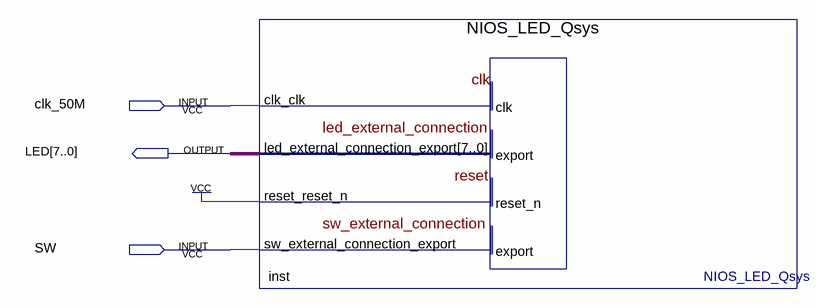
[diagram p0: schematic sheet]
// Quartus schematic LED.bdf as structural Verilog: 1 symbols, 3 pins
module LED (
  input  clk_50M,
  input  SW,
  output [7:0] LED
);

  NIOS_LED_Qsys inst (
    .clk_clk(clk_50M), .reset_reset_n(1'b1), .sw_external_connection_export(SW),
    .led_external_connection_export(LED));
endmodule
